# Altium schematic sheet NAVIGATION - POWER.SchDoc
size A4; SheetNumber: 3; SheetTotal: 7
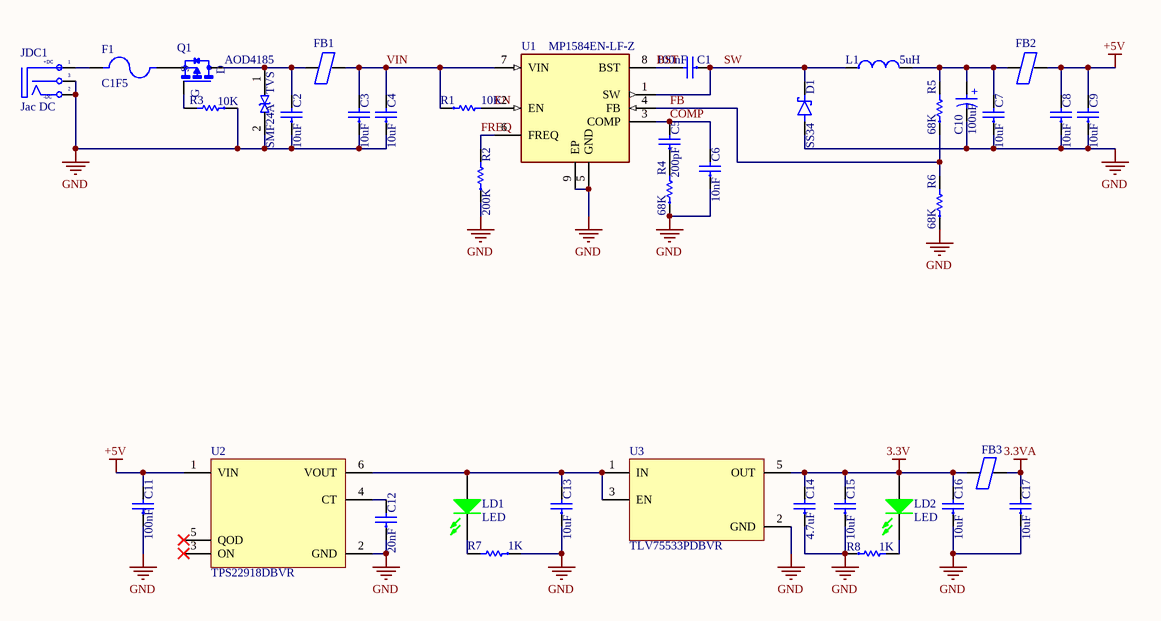
[diagram p0: NAVIGATION - POWER.SchDoc]

## Parts
C1  100nF  [CAP-CER0402-0.5H]
C2  10uF  [CAP-CER0402-20mil]
C3  10uF  [CAP-CER0402-20mil]
C4  10uF  [CAP-CER0402-20mil]
C5  200pF  [CAP-CER0402-0.5H]
C6  10nF  [CAP-CER0402-0.5H]
C7  10uF  [CAP-CER0402-20mil]
C8  10uF  [CAP-CER0402-20mil]
C9  10uF  [CAP-CER0402-20mil]
C10  100uF  [Cap Aluminum Lytic 100uF 35V 20%]
C11  100nF  [CAP-CER0402-20mil]
C12  20nF  [CAP-CER0402-20mil]
C13  10uF  [CAP-CER0402-20mil]
C14  4.7uF  [CAP-CER0402-20mil]
C15  10uF  [CAP-CER0402-20mil]
C16  10uF  [CAP-CER0402-20mil]
C17  10uF  [CAP-CER0402-20mil]
D1  SS34  [DIO_SS34]
F1  C1F5  [FUSE C1F5]
FB1  100MHz 2A 50mOhm  [FB 0603]  (value not drawn)
FB2  100MHz 2A 50mOhm  [FB 0603]  (value not drawn)
FB3  100MHz 2A 50mOhm  [FB 0603]  (value not drawn)
JDC1  Jac DC  [DC0]
L1  5uH  [IND-06030-1uH]
LD1  LED  [LED-IND0402-GRE-0.4H]
LD2  LED  [LED-IND0402-GRE-0.4H]
Q1  AOD4185  [AOD4185]
R1  10K  [RES-CHP0402-0.35H]
R2  200K  [RES-CHP0402-0.35H]
R3  10K  [RES-CHP0402-0.35H]
R4  68K  [RES-CHP0402-0.35H]
R5  68K  [RES-CHP0402-0.35H]
R6  68K  [RES-CHP0402-0.35H]
R7  1K  [RES-CHP0402-0.35H]
R8  1K  [RES-CHP0402-0.35H]
TVS  SMF24A  [TVS24V]
U1  MP1584EN-LF-Z  [SOIC127P600X170-9N]
U2  TPS22918DBVR  [SOT95P280X145-6N]
U3  TLV75533PDBVR  [SOT95P280X145-5N]

## Nets
3.3V: C14.2 C15.2 C16.2 FB3.1 LD2.1(A) U3.5(OUT)
3.3VA: C17.2 FB3.2
+5V: C8.2 C9.2 C11.2 FB2.2 U2.1(VIN)
GND: C2.1 C3.1 C4.1 C6.1 C7.1 C8.1 C9.1 C10.2(N) C11.1 C12.1 C13.1 C14.1 C15.1 C16.1 C17.1 D1.A JDC1.2(TN) JDC1.3(S) R2.1 R3.1 R4.1 R6.1 R7.1 R8.1 TVS.2 U1.5(GND) U1.9(EP) U2.2(GND) U3.2(GND)
BST: C1.2 U1.8(BST)
COMP: C5.2 C6.2 U1.3(COMP)
EN: R1.2 U1.2(EN)
FB: R5.1 R6.2 U1.4(FB)
FREQ: R2.2 U1.6(FREQ)
SW: C1.1 D1.C(K) L1.1 U1.1(SW)
VIN: C3.2 C4.2 FB1.2 R1.1 U1.7(VIN)
NetC2_2: C2.2 FB1.1 Q1.4(D) TVS.1
NetC5_1: C5.1 R4.2
NetC7_2: C7.2 C10.1(P) FB2.1 L1.2 R5.2
NetC12_2: C12.2 U2.4(CT)
NetC13_2: C13.2 LD1.1(A) U2.6(VOUT) U3.1(IN) U3.3(EN)
NetF1_1: F1.1 JDC1.1(T)
NetF1_2: F1.2 Q1.3(S)
NetLD1_2: LD1.2(K) R7.2
NetLD2_2: LD2.2(K) R8.2
NetQ1_1: Q1.1(G) R3.2

Not connected (* = marked no-connect by the designer): U2 3(ON)* 5(QOD)*

## Notes on the sheet
- (in symbol Cap Aluminum Lytic 100uF 35V 20%) +
- (in symbol DCIN) +DC; -DC

## Library data of the parts
C1 = CAPCER0013 100nF 10% 50V X7R 0402 SMD: CAP CER 100nF 10% 50V X7R 0402 SMD; LINE: SMT; TYPE: EP; UNIT: PCS; TMG CODE: None; CERTIFICATION: NA; CLASS: B; MOUNT: SMD; TMG PN: CAPCER0013; ComponentLink1Description: Datasheet; ComponentLink1URL: https://datasheet.lcsc.com/lcsc/1811021431_Samsung-Electro-Mechanics-CL10B104KB8NNNC_C1591.pdf; Footprint: 0402
C2-C4 C7-C9 C11-C17 = CAPCER0040 10uF 20% 6.3V X5R 0402 SMD: CAP CER 10uF 20% 6.3V X5R 0402 SMD; LINE: SMT; TYPE: EP; UNIT: PCS; TMG PN: CAPCER0013; TMG CODE: None; CERTIFICATION: NA; CLASS: B; MOUNT: SMD; ComponentLink1Description: Datasheet; ComponentLink1URL: https://datasheet.lcsc.com/lcsc/2304140030_YAGEO-CC0402MRX5R5BB106_C105884.pdf; Footprint: 0402
C5 C6 = CAPCER0045 10nF 10% 25V X7R 0402 SMD: CAP CER 10nF 10% 25V X7R 0402 SMD; LINE: SMT; TYPE: EP; UNIT: PCS; TMG CODE: None; CERTIFICATION: NA; CLASS: B; MOUNT: SMD; ComponentLink1Description: Datasheet; ComponentLink1URL: https://datasheet.lcsc.com/lcsc/1811141228_YAGEO-CC0402KRX7R8BB103_C327025.pdf
C10 = Cap Aluminum Lytic 100uF 35V 20%: Cap Aluminum Lytic 100uF 35V 20% (6.3 X 7.7mm) SMD 300mA 2000h 105C T/R; Manufacturer: Wurth Electronics; Manufacturer Part Number: 865080545012; Dissipation Factor: 14%; ESR (Equivalent Series Resistance): 321.392mR; Insulation Resistance: 1MR; Leakage Current: 35uA; Supplier 1: Digikey; RoHS: Yes; Category: Aluminum Electrolytic Capacitors; Stock 1: 37792; Pricing 1: 1=0.31, 50=0.2674, 100=0.2322, 250=0.207, 900=0.1809, 1800=0.1719 (USD); Ripple Current: 300mA; Voltage Rating (DC): 35V; Length: 7.7mm; Width: 6.6mm; ComponentLink1URL: http://www.farnell.com/datasheets/1880164.pdf?src-supplier=Farnell; ComponentLink1Description: http://www.farnell.com/datasheets/1880164.pdf?src-supplier=Farnell; ComponentLink2URL: http://www.farnell.com/datasheets/1880164.pdf?src-supplier=Newark; ComponentLink2Description: http://www.farnell.com/datasheets/1880164.pdf?src-supplier=Newark; ComponentLink3URL: https://katalog.we-online.de/pbs/datasheet/865080545012.pdf?src-supplier=Digikey; ComponentLink3Description: https://katalog.we-online.de/pbs/datasheet/865080545012.pdf?src-supplier=Digikey; ComponentLink4URL: http://www.farnell.com/datasheets/1880164.pdf?src-supplier=Element14; ComponentLink4Description: http://www.farnell.com/datasheets/1880164.pdf?src-supplier=Element14; Supplier Part Number 1: 732-8511-1-ND
D1 = SS34: 3A, 40V, Schottky Rectifier; MF: Taiwan Semiconductor; SnapEDA_Link: https://www.snapeda.com/parts/SS34/Taiwan+Semiconductor/view-part/?ref=snap; Package: DO-214AB-2 Taiwan Semiconductor; Value: *; MP: SS34; Check_prices: https://www.snapeda.com/parts/SS34/Taiwan+Semiconductor/view-part/?ref=eda
F1 = C1F5: Fuse Chip Fast Acting 5A 125V SMD Solder Pad 1206 3.2 X 1.58 X 0.63mm; Manufacturer: Bel TRP; Voltage Rating (DC): 63V; DC Cold Resistance: 20mR; Fuse Type: Board Mount (Cartridge Style Excluded); Supplier 1: Newark; Manufacturer Part Number: C1F5; RoHS: Yes; Category: Uncategorized; Mount: Surface Mount; Case/Package: 1206; Number of Pins: 2; Contact Plating: Tin; Case Code (Metric): 3216; Case Code (Imperial): 1206; Min Operating Temperature: -55°C; Max Operating Temperature: 125°C; Packaging: Cut Tape; Voltage Rating: 125V; Series: C1F; Voltage Rating (AC): 125V; ComponentLink1URL: http://www.mouser.com/ds/2/643/C1F-594910.pdf?src-supplier=Mouser; ComponentLink1Description: http://www.mouser.com/ds/2/643/C1F-594910.pdf?src-supplier=Mouser; ComponentLink2URL: http://belfuse.com/pdfs/C1F.pdf?src-supplier=Avnet; ComponentLink2Description: http://belfuse.com/pdfs/C1F.pdf?src-supplier=Avnet; ComponentLink3URL: https://belfuse.com/resources/datasheets/circuitprotection/ds-cp-c1f-series.pdf?src-supplier=Digikey; ComponentLink3Description: https://belfuse.com/resources/datasheets/circuitprotection/ds-cp-c1f-series.pdf?src-supplier=Digikey; Supplier Part Number 1: 48AC8480
FB1-FB3 = BLM18PG121SN1D: Ferrite Beads Multi-Layer 120Ohm 25% 100MHz 2A 50mOhm DCR 0603 Paper T/R; Manufacturer: Murata; Material: Steel,Ferrite; Impedance: 120R; Number of Lines: 1; DC Resistance (DCR): 50mR; Number of Circuits: 1NUMBER; Shielding: 202Shielding; Supplier 1: Mouser; Manufacturer Part Number: BLM18PG121SN1D; RoHS: Yes; Category: Ferrite Beads and Chips; Stock 1: 377848; Pricing 1: 1=0.1, 10=0.059, 50=0.047, 100=0.042, 1000=0.029, 10000=0.018 (USD); Case/Package: 0603; Number of Pins: 2; Core Material: Ferrite; Case Code (Metric): 1608; Case Code (Imperial): 0603; Min Operating Temperature: -55°C; Max Operating Temperature: 125°C; Tolerance: 25%; Package Quantity: 1; Max Current Rating: 2A; Packaging: Tape and Reel; Current Rating: 2A; Max DC Current: 2A; Termination: SMD/SMT; Test Frequency: 100MHz; DC Current: 2A; Frequency: 100MHz; Series: BLM18P; DC Resistance-Max: 50mR; RMS Current (Irms): 2A; Series Resistance: 50mR; Length: 1.6mm; Width: 0.8mm; Height: 0.8mm; Depth: 0.8mm; Radiation Hardening: No; Reach SVHC Compliant: No; Lead Free: Lead Free; RoHS Compliant: Yes; ComponentLink1URL: https://datasheet.ciiva.com/5709/1740433-5709171.pdf?src-supplier=Farnell; ComponentLink1Description: https://datasheet.ciiva.com/5709/1740433-5709171.pdf?src-supplier=Farnell; ComponentLink2URL: https://datasheet.ciiva.com/19454/1845013-19454715.pdf?src-supplier=Jameco; ComponentLink2Description: https://datasheet.ciiva.com/19454/1845013-19454715.pdf?src-supplier=Jameco; ComponentLink3URL: https://datasheet.ciiva.com/11799/0900766b81275ca5-11799546.pdf?src-supplier=Rs; ComponentLink3Description: https://datasheet.ciiva.com/11799/0900766b81275ca5-11799546.pdf?src-supplier=Rs; ComponentLink4URL: https://datasheet.ciiva.com/3854/5emiapbde-1-3854039.pdf?src-supplier=Arrow+Electronics; ComponentLink4Description: https://datasheet.ciiva.com/3854/5emiapbde-1-3854039.pdf?src-supplier=Arrow+Electronics; ComponentLink5URL: https://datasheet.ciiva.com/29347/442365-da-01-en-chip-drossel-0603-120r-2000ma-1-6x0-8mm-29347911.pdf?src-supplier=Conrad; ComponentLink5Description: https://datasheet.ciiva.com/29347/442365-da-01-en-chip-drossel-0603-120r-2000ma-1-6x0-8mm-29347911.pdf?src-supplier=Conrad; ComponentLink6URL: https://datasheet.ciiva.com/8021/1740433-8021493.pdf?src-supplier=Element14; ComponentLink6Description: https://datasheet.ciiva.com/8021/1740433-8021493.pdf?src-supplier=Element14; ComponentLink7URL: https://datasheet.ciiva.com/8021/1740433-8021494.pdf?src-supplier=Element14; ComponentLink7Description: https://datasheet.ciiva.com/8021/1740433-8021494.pdf?src-supplier=Element14; ComponentLink8URL: https://datasheet.ciiva.com/14122/blm-series-eng-tds-14122905.pdf?src-supplier=Distrelec; ComponentLink8Description: https://datasheet.ciiva.com/14122/blm-series-eng-tds-14122905.pdf?src-supplier=Distrelec; ComponentLink9URL: https://datasheet.ciiva.com/6212/l0110s0100blm18p-6212502.pdf?src-supplier=Digikey; ComponentLink9Description: https://datasheet.ciiva.com/6212/l0110s0100blm18p-6212502.pdf?src-supplier=Digikey; ComponentLink10URL: https://datasheet.ciiva.com/6212/l0110s0100blm18p-6212504.pdf?src-supplier=Digikey; ComponentLink10Description: https://datasheet.ciiva.com/6212/l0110s0100blm18p-6212504.pdf?src-supplier=Digikey; ComponentLink11URL: https://datasheet.ciiva.com/3081/l0110s0100blm18p-3081632.pdf?src-supplier=Avnet; ComponentLink11Description: https://datasheet.ciiva.com/3081/l0110s0100blm18p-3081632.pdf?src-supplier=Avnet; ComponentLink12URL: https://datasheet.ciiva.com/41449/001172297-da-01-en-drossel-0603-120r-1-6x0-8mm-4000st-41449659.pdf?src-supplier=Conrad; ComponentLink12Description: https://datasheet.ciiva.com/41449/001172297-da-01-en-drossel-0603-120r-1-6x0-8mm-4000st-41449659.pdf?src-supplier=Conrad; Supplier Part Number 1: 81-BLM18PG121SN1D
JDC1 = DCIN: Jac DC input; Value: Jac DC
L1 = INDMOI0013 1W2T 1.5uH 20% 14A 0630 SMD: IND MOI 1W2T 1.5uH 20% 14A 0630 SMD; LINE: SMT; TYPE: EP; UNIT: PCS; TMG CODE: None; CERTIFICATION: NA; CLASS: B; MOUNT: SMD; ComponentLink1Description: Datasheet; ComponentLink1URL: https://datasheet.lcsc.com/lcsc/2210101130_SHOU-HAN-CYA0630-1-5UH_C5189745.pdf
LD1 LD2 = LEDIND0005 GRE CLR 2.4V 20mA 0402 SMD: LED IND GRE CLR 2.4V 20mA 0402 SMD; LINE: SMT; TYPE: EP; UNIT: PCS; TMG CODE: None; CERTIFICATION: NA; CLASS: B; MOUNT: SMD; ComponentLink1Description: Datasheet; ComponentLink1URL: https://datasheet.lcsc.com/lcsc/2102221739_Yongyu-Photoelectric-SZYY0402YG_C434449.pdf
Q1 = AOD4185: Trans MOSFET P-CH 40V 40A 3-Pin(2+Tab) DPAK; Manufacturer: Alpha & Omega Semiconductor; Supplier 1: Digikey; Manufacturer Part Number: AOD4185; RoHS: Yes; Category: Transistors; Stock 1: 1666; Pricing 1: 1=1.22, 10=0.766, 100=0.5048, 500=0.3923, 1000=0.35608 (USD); ComponentLink1URL: https://datasheet.ciiva.com/951/aod4185-951090.pdf?src-supplier=Digikey; ComponentLink1Description: https://datasheet.ciiva.com/951/aod4185-951090.pdf?src-supplier=Digikey; ComponentLink2URL: https://datasheet.ciiva.com/6384/aod4185-6384890.pdf?src-supplier=Digikey; ComponentLink2Description: https://datasheet.ciiva.com/6384/aod4185-6384890.pdf?src-supplier=Digikey; ComponentLink3URL: https://datasheet.ciiva.com/6384/aod4185-6384893.pdf?src-supplier=Digikey; ComponentLink3Description: https://datasheet.ciiva.com/6384/aod4185-6384893.pdf?src-supplier=Digikey; Supplier Part Number 1: 785-1222-1-ND
R1 = RESCHP0073 10K 1% 0402 SMD: RES CHP 10K 1% 1/16W 0402 SMD; LINE: SMT; UNIT: PCS; TMG CODE: None; CERTIFICATION: NA; CLASS: B; MOUNT: SMD; TYPE: EP; TMG PN: RESCHP0073; ComponentLink1Description: Datasheet; ComponentLink1URL: https://datasheet.lcsc.com/lcsc/2304140030_YAGEO-AC0402FR-0710KL_C144807.pdf; Footprint: 0402
R2-R8 = RESCHP0097 100K 1% 0402 SMD: RES CHP 100K 1% 1/16W 0402 SMD; LINE: SMT; UNIT: PCS; TMG CODE: None; CERTIFICATION: NA; CLASS: B; MOUNT: SMD; TYPE: EP; ComponentLink1Description: Datasheet; ComponentLink1URL: https://datasheet.lcsc.com/lcsc/2304140030_YAGEO-AC0402FR-0710KL_C144807.pdf
TVS = SMF24A: TVS DIODE 24VWM 38.9VC SOD123F; Manufacturer: Littelfuse; Supplier 1: Digikey; Manufacturer Part Number: SMF24A; RoHS: Yes; Category: TVS Diodes; Stock 1: 51545; Pricing 1: 1=0.28, 10=0.225, 100=0.114, 500=0.111, 1000=0.108 (USD); ComponentLink1URL: https://datasheet.ciiva.com/6578/littelfuse-tvs-diode-smf-datasheet-pdf-6578345.pdf?src-supplier=Digikey; ComponentLink1Description: https://datasheet.ciiva.com/6578/littelfuse-tvs-diode-smf-datasheet-pdf-6578345.pdf?src-supplier=Digikey; ComponentLink2URL: https://datasheet.ciiva.com/6578/littelfuse-tvs-diode-smf-datasheet-pdf-6578346.pdf?src-supplier=Digikey; ComponentLink2Description: https://datasheet.ciiva.com/6578/littelfuse-tvs-diode-smf-datasheet-pdf-6578346.pdf?src-supplier=Digikey; ComponentLink3URL: https://datasheet.ciiva.com/6578/littelfuse-tvs-diode-smf-datasheet-pdf-6578347.pdf?src-supplier=Digikey; ComponentLink3Description: https://datasheet.ciiva.com/6578/littelfuse-tvs-diode-smf-datasheet-pdf-6578347.pdf?src-supplier=Digikey; Supplier Part Number 1: F5823CT-ND
U1 = MP1584EN-LF-Z: Buck Switching Regulator IC Positive Adjustable 0.8V 1 Output 3A 8-SOIC (0.154, 3.90mm Width) Exposed Pad; MF: Monolithic Power Systems; MP: MP1584ENLFZ; SnapEDA_Link: https://www.snapeda.com/parts/MP1584ENLFZ/Monolithic+Power+Systems/view-part/?ref=snap; Package: SOIC-8 Monolithic Power Systems; Value: *; Check_prices: https://www.snapeda.com/parts/MP1584ENLFZ/Monolithic+Power+Systems/view-part/?ref=eda
U2 = TPS22918DBVR: 5.5-V, 2-A, 52-mÎ© load switch with adj. rise time and adj. output discharge; MF: Texas Instruments; SnapEDA_Link: https://www.snapeda.com/parts/TPS22918DBVR/Texas+Instruments/view-part/?ref=snap; Package: SOT-23-6 Texas Instruments; Value: *; MP: TPS22918DBVR; Check_prices: https://www.snapeda.com/parts/TPS22918DBVR/Texas+Instruments/view-part/?ref=eda
U3 = TLV75533PDBVR: 500-mA High-PSRR Low-IQ-Tief-Dropout-Spannungsregler mitablem; MF: Texas Instruments; SnapEDA_Link: https://www.snapeda.com/parts/TLV75533PDBVR/Texas+Instruments/view-part/?ref=snap; Package: SOT-23-5 Texas Instruments; Value: *; MP: TLV75533PDBVR; Check_prices: https://www.snapeda.com/parts/TLV75533PDBVR/Texas+Instruments/view-part/?ref=eda